# Altium schematic sheet 1_wiring drawing.SchDoc: POWER & CAN
size A2; ApprovedBy: Approved By; CheckedBy: Sky; DrawnBy: Jack; Address1: 1; Address2: 2; Address3: 3; Address4: 4; DocumentNumber: 04-TE-42-4015-0PA-A; Revision: B; SheetNumber: 2; SheetTotal: 6; SheetSize: A2; CheckedByDate: 2022-11-19; DrawByDate: 2022-11-17; SiteName: EMS TD Huangpu; PageSetup: Record=PageOptions|CenterHorizontal=True|CenterVertical=True|PrintScale=0.73|XCorrection=1.00|YCorrection=1.00|PrintKind=0|BorderSize=5000000|LeftOffset=0|BottomOffset=0|Orientation=2|PaperLength=1000|PaperWidth=1000|Scale=100|PaperSource=15|PrintQuality=1200|MediaType=1|DitherType=10|PaperKind=A3|PrintScaleMode=1; ProjectName: 19205_BMW CCU DDR PCBA FT fixture wiring
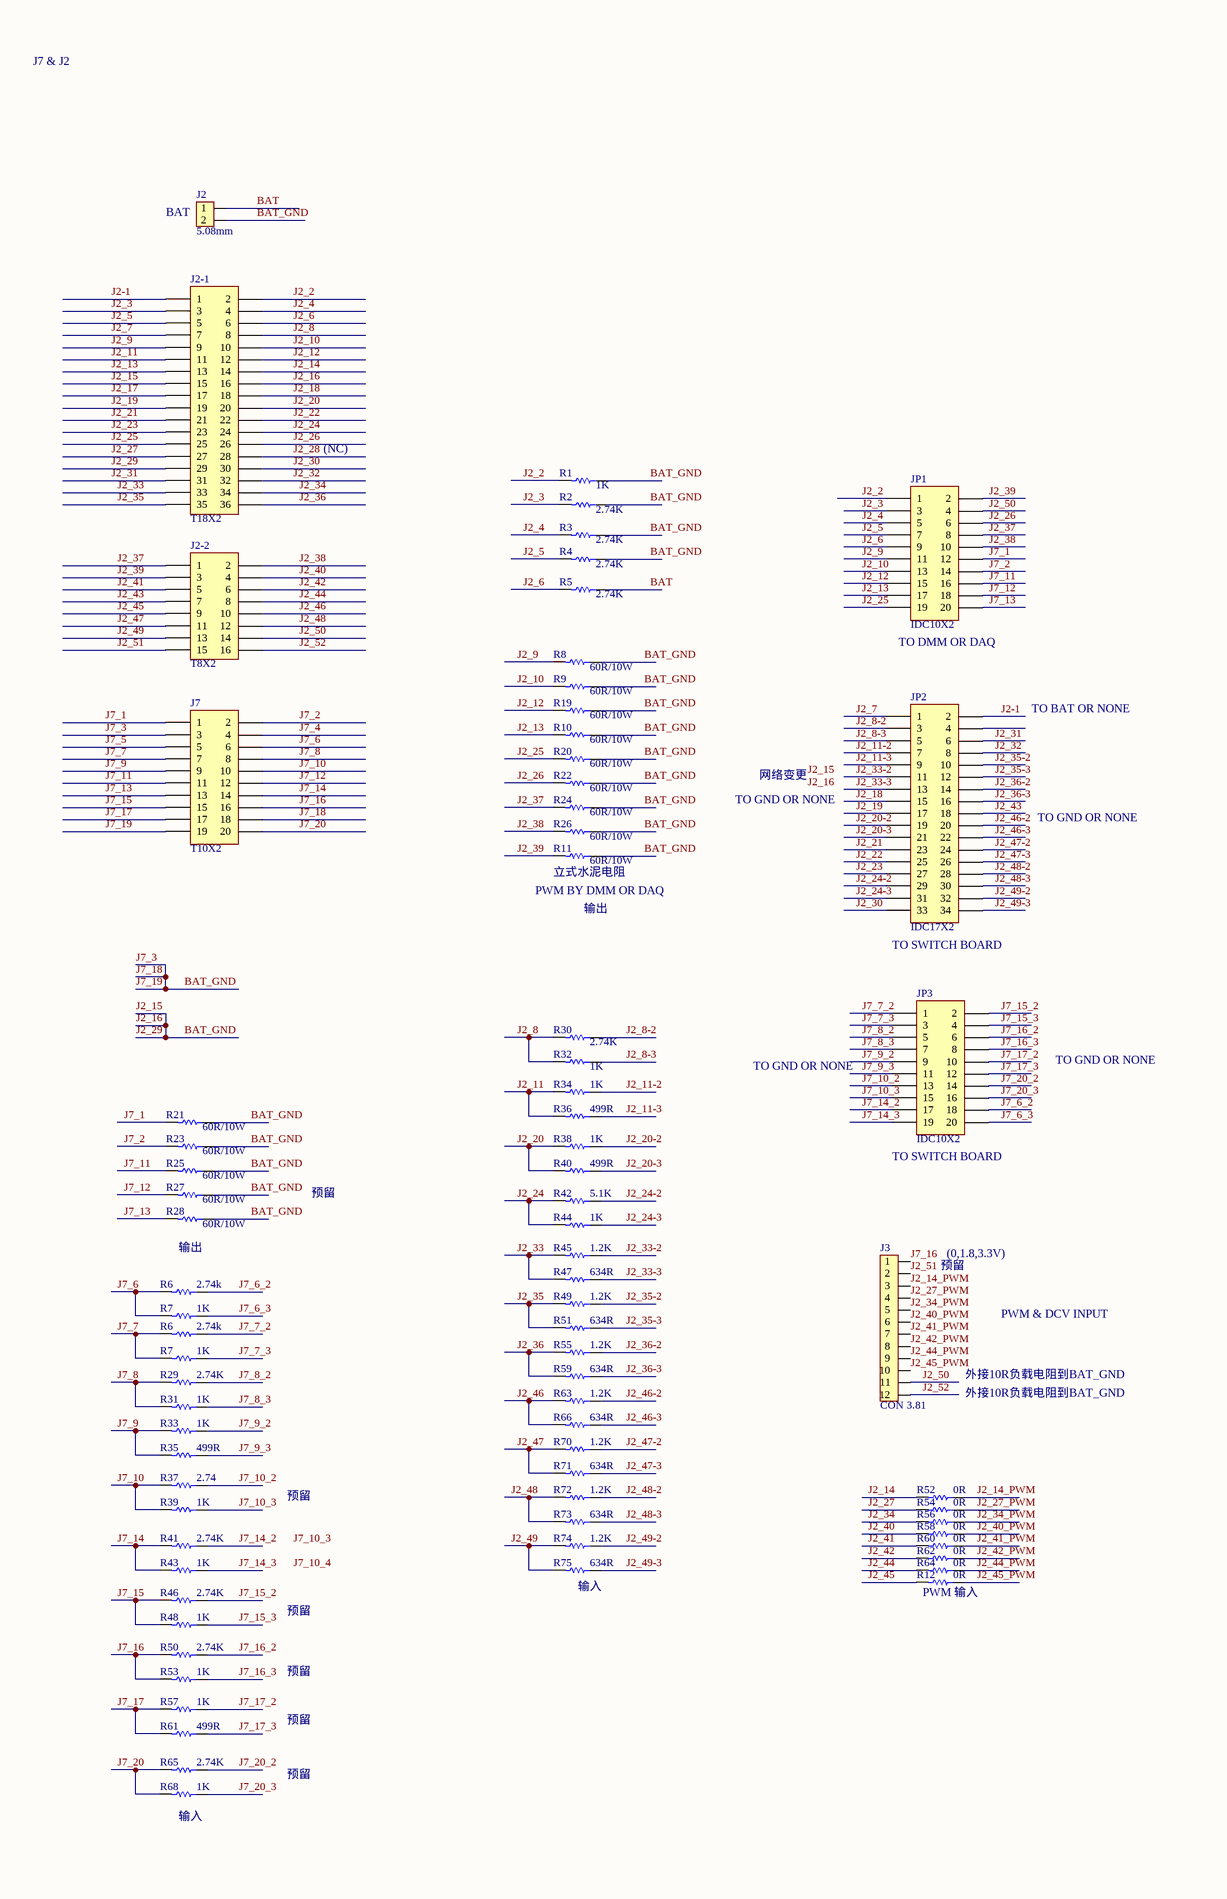
[diagram p0: 1_wiring drawing.SchDoc, left]
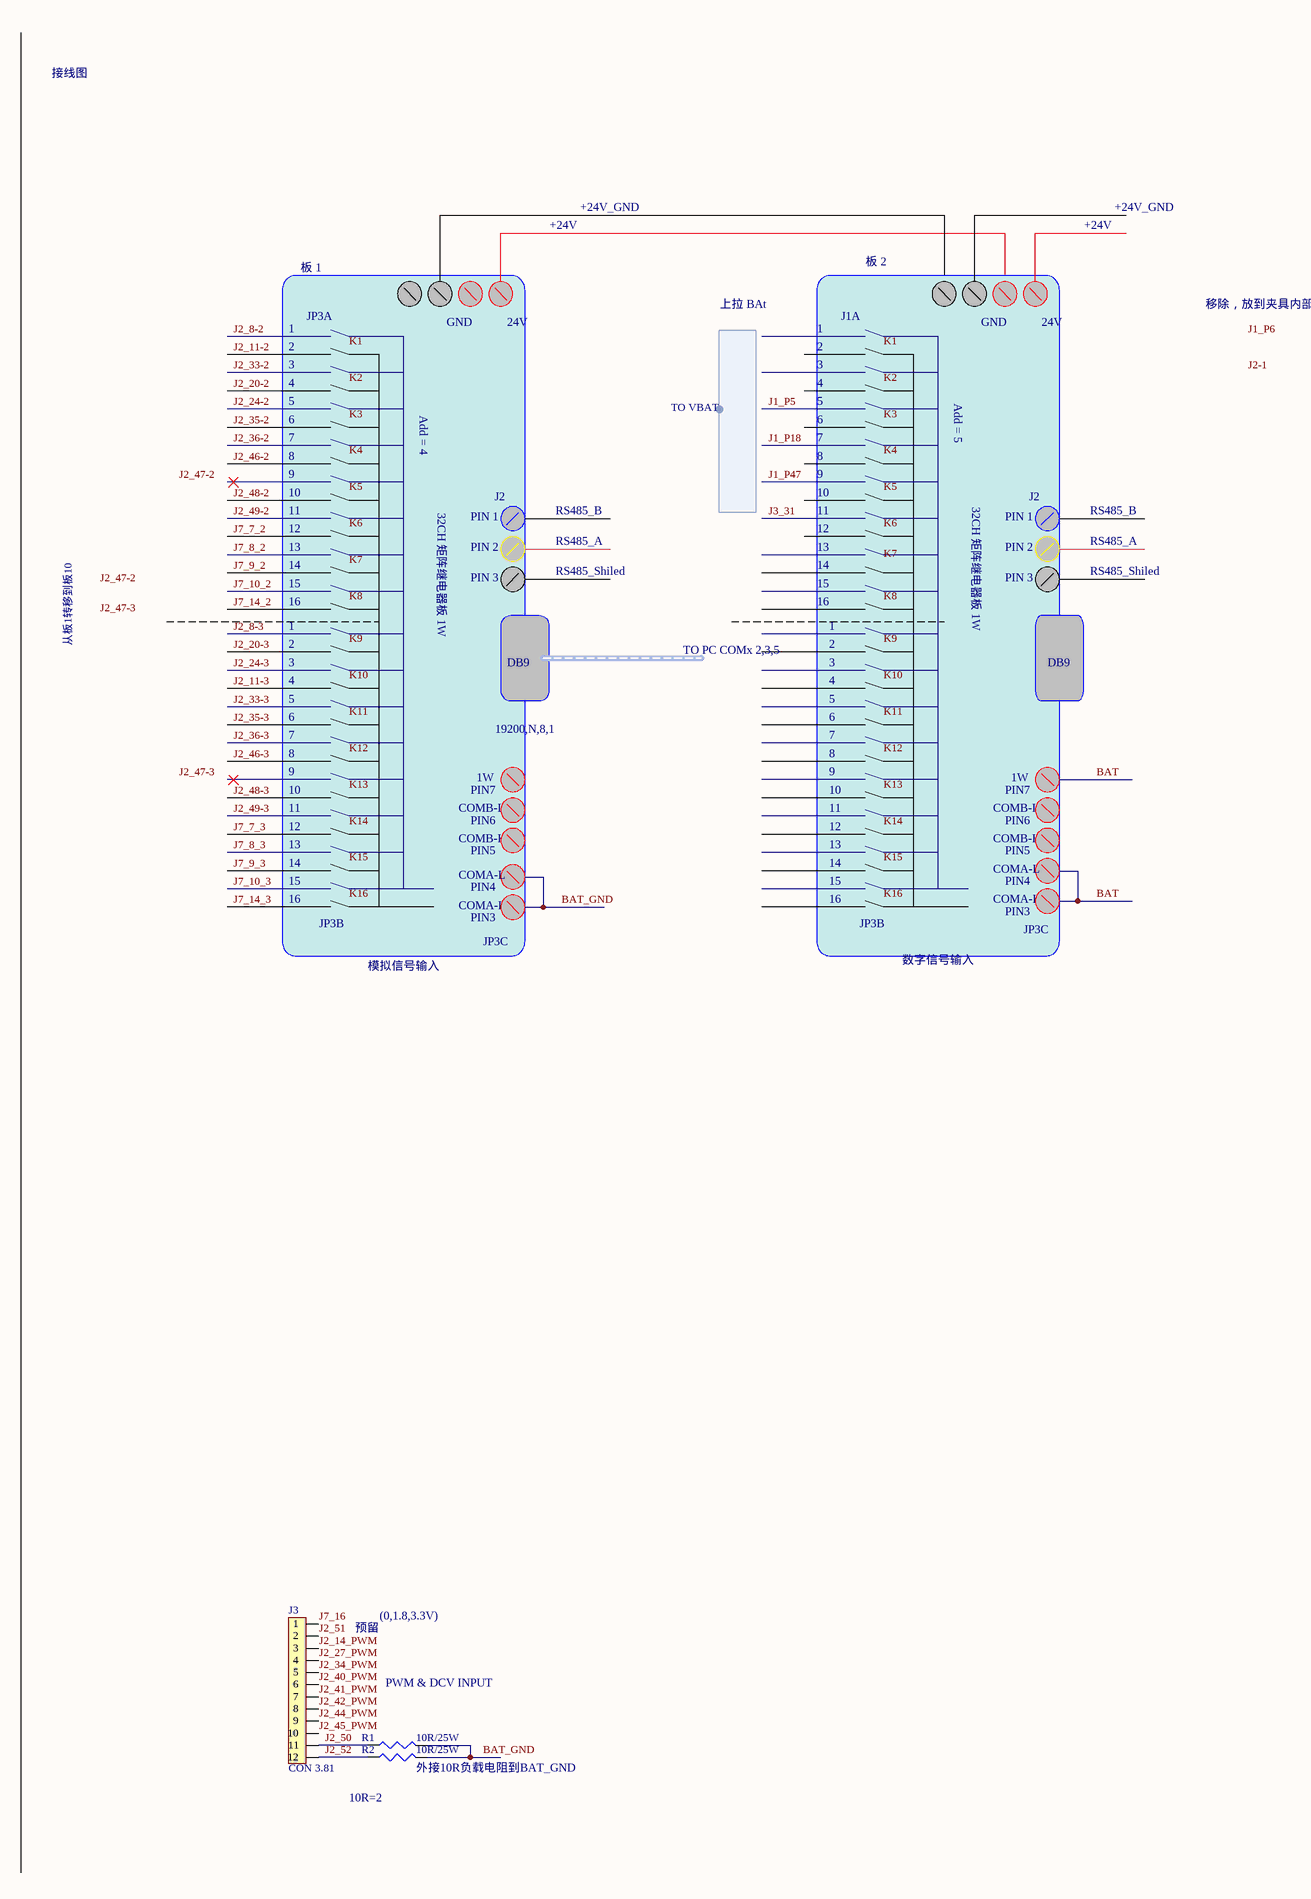
[diagram p1: 1_wiring drawing.SchDoc, right]

## Parts
(Parts that share a designator on the sheet are numbered #1, #2 ... from top to bottom, then left to right.)
J2  5.08mm  [3.81mm-2]
J2-1  T18X2  [T18X2-bend]
J2-2  T8X2
J3#1  CON 3.81  [3.81mm-12]
J3#2  CON 3.81  [3.81mm-12]
J7  T10X2  [T10X2-bend]
JP1  IDC10X2  [IDC20]
JP2  IDC17X2  [IDC34]
JP3  IDC10X2  [IDC20]
R1#1  1K  [AXIAL-0.25W]
R1#2  10R/25W  [R AXIAL0.4]
R2#1  2.74K  [AXIAL-0.25W]
R2#2  10R/25W  [R AXIAL0.4]
R3  2.74K  [AXIAL-0.25W]
R4  2.74K  [AXIAL-0.25W]
R5  2.74K  [AXIAL-0.25W]
R6#1  2.74k  [AXIAL-0.25W]
R6#2  2.74k  [AXIAL-0.25W]
R7#1  1K  [AXIAL-0.25W]
R7#2  1K  [AXIAL-0.25W]
R8  60R/10W  [立式10W]
R9  60R/10W  [立式10W]
R10  60R/10W  [立式10W]
R11  60R/10W  [立式10W]
R12  0R  [AXIAL-0.25W]
R19  60R/10W  [立式10W]
R20  60R/10W  [立式10W]
R21  60R/10W  [立式10W]
R22  60R/10W  [立式10W]
R23  60R/10W  [立式10W]
R24  60R/10W  [立式10W]
R25  60R/10W  [立式10W]
R26  60R/10W  [立式10W]
R27  60R/10W  [立式10W]
R28  60R/10W  [立式10W]
R29  2.74K  [AXIAL-0.25W]
R30  2.74K  [AXIAL-0.25W]
R31  1K  [AXIAL-0.25W]
R32  1K  [AXIAL-0.25W]
R33  1K  [AXIAL-0.25W]
R34  1K  [AXIAL-0.25W]
R35  499R  [AXIAL-0.25W]
R36  499R  [AXIAL-0.25W]
R37  2.74  [AXIAL-0.25W]
R38  1K  [AXIAL-0.25W]
R39  1K  [AXIAL-0.25W]
R40  499R  [AXIAL-0.25W]
R41  2.74K  [AXIAL-0.25W]
R42  5.1K  [AXIAL-0.25W]
R43  1K  [AXIAL-0.25W]
R44  1K  [AXIAL-0.25W]
R45  1.2K  [AXIAL-0.25W]
R46  2.74K  [AXIAL-0.25W]
R47  634R  [AXIAL-0.25W]
R48  1K  [AXIAL-0.25W]
R49  1.2K  [AXIAL-0.25W]
R50  2.74K  [AXIAL-0.25W]
R51  634R  [AXIAL-0.25W]
R52  0R  [AXIAL-0.25W]
R53  1K  [AXIAL-0.25W]
R54  0R  [AXIAL-0.25W]
R55  1.2K  [AXIAL-0.25W]
R56  0R  [AXIAL-0.25W]
R57  1K  [AXIAL-0.25W]
R58  0R  [AXIAL-0.25W]
R59  634R  [AXIAL-0.25W]
R60  0R  [AXIAL-0.25W]
R61  499R  [AXIAL-0.25W]
R62  0R  [AXIAL-0.25W]
R63  1.2K  [AXIAL-0.25W]
R64  0R  [AXIAL-0.25W]
R65  2.74K  [AXIAL-0.25W]
R66  634R  [AXIAL-0.25W]
R68  1K  [AXIAL-0.25W]
R70  1.2K  [AXIAL-0.25W]
R71  634R  [AXIAL-0.25W]
R72  1.2K  [AXIAL-0.25W]
R73  634R  [AXIAL-0.25W]
R74  1.2K  [AXIAL-0.25W]
R75  634R  [AXIAL-0.25W]

## Harnesses
TO VBAT: 

## Nets
BAT: J2.1 R5.2
BAT_GND: J2.2 J2-1.15 J2-1.16 J2-1.29 J7.3 J7.18 J7.19 R1#1.2 R1#2.2 R2#1.2 R2#2.2 R3.2 R4.2 R8.2 R9.2 R10.2 R11.2 R19.2 R20.2 R21.2 R22.2 R23.2 R24.2 R25.2 R26.2 R27.2 R28.2  [also labelled J2_15, J2_16, J2_29, J7_18, J7_19, J7_3]
J2-1: J2-1.1 JP2.2
J2_2: J2-1.2 JP1.1 R1#1.1
J2_3: J2-1.3 JP1.3 R2#1.1
J2_4: J2-1.4 JP1.5 R3.1
J2_5: J2-1.5 JP1.7 R4.1
J2_6: J2-1.6 JP1.9 R5.1
J2_7: J2-1.7 JP2.1
J2_8: J2-1.8 R30.1 R32.1
J2_8-2: JP2.3 R30.2
J2_8-3: JP2.5 R32.2
J2_9: J2-1.9 JP1.11 R8.1
J2_10: J2-1.10 JP1.13 R9.1
J2_11: J2-1.11 R34.1 R36.1
J2_11-2: JP2.7 R34.2
J2_11-3: JP2.9 R36.2
J2_12: J2-1.12 JP1.15 R19.1
J2_13: J2-1.13 JP1.17 R10.1
J2_14: J2-1.14 R52.1
J2_14_PWM: J3#1.3 J3#2.3 R52.2
J2_17: J2-1.17
J2_18: J2-1.18 JP2.15
J2_19: J2-1.19 JP2.17
J2_20: J2-1.20 R38.1 R40.1
J2_20-2: JP2.19 R38.2
J2_20-3: JP2.21 R40.2
J2_21: J2-1.21 JP2.23
J2_22: J2-1.22 JP2.25
J2_23: J2-1.23 JP2.27
J2_24: J2-1.24 R42.1 R44.1
J2_24-2: JP2.29 R42.2
J2_24-3: JP2.31 R44.2
J2_25: J2-1.25 JP1.19 R20.1
J2_26: J2-1.26 JP1.6 R22.1
J2_27: J2-1.27 R54.1
J2_27_PWM: J3#1.4 J3#2.4 R54.2
J2_28: J2-1.28
J2_30: J2-1.30 JP2.33
J2_31: J2-1.31 JP2.6
J2_32: J2-1.32 JP2.8
J2_33: J2-1.33 R45.1 R47.1
J2_33-2: JP2.11 R45.2
J2_33-3: JP2.13 R47.2
J2_34: J2-1.34 R56.1
J2_34_PWM: J3#1.5 J3#2.5 R56.2
J2_35: J2-1.35 R49.1 R51.1
J2_35-2: JP2.10 R49.2
J2_35-3: JP2.12 R51.2
J2_36: J2-1.36 R55.1 R59.1
J2_36-2: JP2.14 R55.2
J2_36-3: JP2.16 R59.2
J2_37: J2-2.1 JP1.8 R24.1
J2_38: J2-2.2 JP1.10 R26.1
J2_39: J2-2.3 JP1.2 R11.1
J2_40: J2-2.4 R58.1
J2_40_PWM: J3#1.6 J3#2.6 R58.2
J2_41: J2-2.5 R60.1
J2_41_PWM: J3#1.7 J3#2.7 R60.2
J2_42: J2-2.6 R62.1
J2_42_PWM: J3#1.8 J3#2.8 R62.2
J2_43: J2-2.7 JP2.18
J2_44: J2-2.8 R64.1
J2_44_PWM: J3#1.9 J3#2.9 R64.2
J2_45: J2-2.9 R12.1
J2_45_PWM: J3#1.10 J3#2.10 R12.2
J2_46: J2-2.10 R63.1 R66.1
J2_46-2: JP2.20 R63.2
J2_46-3: JP2.22 R66.2
J2_47: J2-2.11 R70.1 R71.1
J2_47-2: JP2.24 R70.2
J2_47-3: JP2.26 R71.2
J2_48: J2-2.12 R72.1 R73.1
J2_48-2: JP2.28 R72.2
J2_48-3: JP2.30 R73.2
J2_49: J2-2.13 R74.1 R75.1
J2_49-2: JP2.32 R74.2
J2_49-3: JP2.34 R75.2
J2_50: J2-2.14 J3#1.11 J3#2.11 JP1.4 R1#2.1
J2_51: J2-2.15 J3#1.2 J3#2.2
J2_52: J2-2.16 J3#1.12 J3#2.12 R2#2.1
J7_1: J7.1 JP1.12 R21.1
J7_2: J7.2 JP1.14 R23.1
J7_4: J7.4
J7_5: J7.5
J7_6: J7.6 R6#1.1 R7#1.1
J7_6_2: JP3.18 R6#1.2
J7_6_3: JP3.20 R7#1.2
J7_7: J7.7 R6#2.1 R7#2.1
J7_7_2: JP3.1 R6#2.2
J7_7_3: JP3.3 R7#2.2
J7_8: J7.8 R29.1 R31.1
J7_8_2: JP3.5 R29.2
J7_8_3: JP3.7 R31.2
J7_9: J7.9 R33.1 R35.1
J7_9_2: JP3.9 R33.2
J7_9_3: JP3.11 R35.2
J7_10: J7.10 R37.1 R39.1
J7_10_2: JP3.13 R37.2
J7_10_3: JP3.15 R39.2
J7_11: J7.11 JP1.16 R25.1
J7_12: J7.12 JP1.18 R27.1
J7_13: J7.13 JP1.20 R28.1
J7_14: J7.14 R41.1 R43.1
J7_14_2: JP3.17 R41.2
J7_14_3: JP3.19 R43.2
J7_15: J7.15 R46.1 R48.1
J7_15_2: JP3.2 R46.2
J7_15_3: JP3.4 R48.2
J7_16: J3#1.1 J3#2.1 J7.16 R50.1 R53.1
J7_16_2: JP3.6 R50.2
J7_16_3: JP3.8 R53.2
J7_17: J7.17 R57.1 R61.1
J7_17_2: JP3.10 R57.2
J7_17_3: JP3.12 R61.2
J7_20: J7.20 R65.1 R68.1
J7_20_2: JP3.14 R65.2
J7_20_3: JP3.16 R68.2

Not connected (* = marked no-connect by the designer): JP2 4

## Notes on the sheet
- J7 & J2
- 接线图
- (near J2) BAT
- +24V
- +24V_GND
- 板 1
- 板 2
- 1
- 2
- JP3A
- GND
- 24V
- 上拉 BAt
- J1A
- 移除，放到夹具内部
- 3
- 4
- 5
- Add = 5
- (NC)
- 6
- 7
- 8
- Add = 4
- 9
- 10
- 11
- 32CH 矩阵继电器板 1W
- PIN 1
- J2
- RS485_B
- 12
- 13
- 14
- 15
- PIN 2
- PIN 3
- RS485_A
- RS485_Shiled
- (near JP1) TO DMM OR DAQ
- 从板1转移到板10
- 16
- TO BAT OR NONE
- DB9
- TO PC COMx 2,3,5
- 19200,N,8,1
- TO GND OR NONE
- 网络变更
- COMB-L
- PIN6
- PIN7
- 1W
- (near R11) 立式水泥电阻
- COMB-H
- COMA-L
- PIN4
- PIN5
- (near R11) PWM BY DMM OR DAQ
- 输出
- (near JP2) TO SWITCH BOARD
- JP3B
- COMA-H
- PIN3
- JP3C
- 模拟信号输入
- 数字信号输入
- 预留
- (near JP3) TO SWITCH BOARD
- (near J3#1) 预留
- (0,1.8,3.3V)
- PWM & DCV INPUT
- 外接10R负载电阻到BAT_GND
- (near R75) 输入
- (near R12) PWM 输入
- 10R=2
- (near R2#2) 外接10R负载电阻到BAT_GND
- (near R68) 输入
- Labels drawn without touching a wire or pin: J1_P5, J1_P6, J1_P18, J1_P47, J2-1, J2_8-2, J2_8-3, J2_11-2, J2_11-3, J2_15, J2_16, J2_20-2, J2_20-3, J2_24-2, J2_24-3, J2_33-2, J2_33-3, J2_35-2, J2_35-3, J2_36-2, J2_36-3, J2_46-2, J2_46-3, J2_47-2, J2_47-3, J2_48-2, J2_48-3, J2_49-2, J2_49-3, J3_31, J7_7_2, J7_7_3, J7_8_2, J7_8_3, J7_9_2, J7_9_3, J7_10_2, J7_10_3, J7_10_4, J7_14_2, J7_14_3, K1, K2, K3, K4, K5, K6, K7, K8, K9, K10, K11, K12, K13, K14, K15, K16
- Document Number:
- Rev:
- YUANCHEN
- 源 辰
- Project Name:
- Drawn By:
- Date:
- Titile:
- Checked By:
- Sheet:
- Of

## Library data of the parts
J2 = CON2-3.81
J3#1 J3#2 = CON12-2.54
J7 = IDC10X2
R1#1 R2#1 R3-R5 R6#1 R6#2 R7#1 R7#2 R8-R12 R19-R66 R68 R70-R75 = RES1
R1#2 R2#2 = RES2